# EAGLE design Precision Rectifier (EAGLE 5.11)
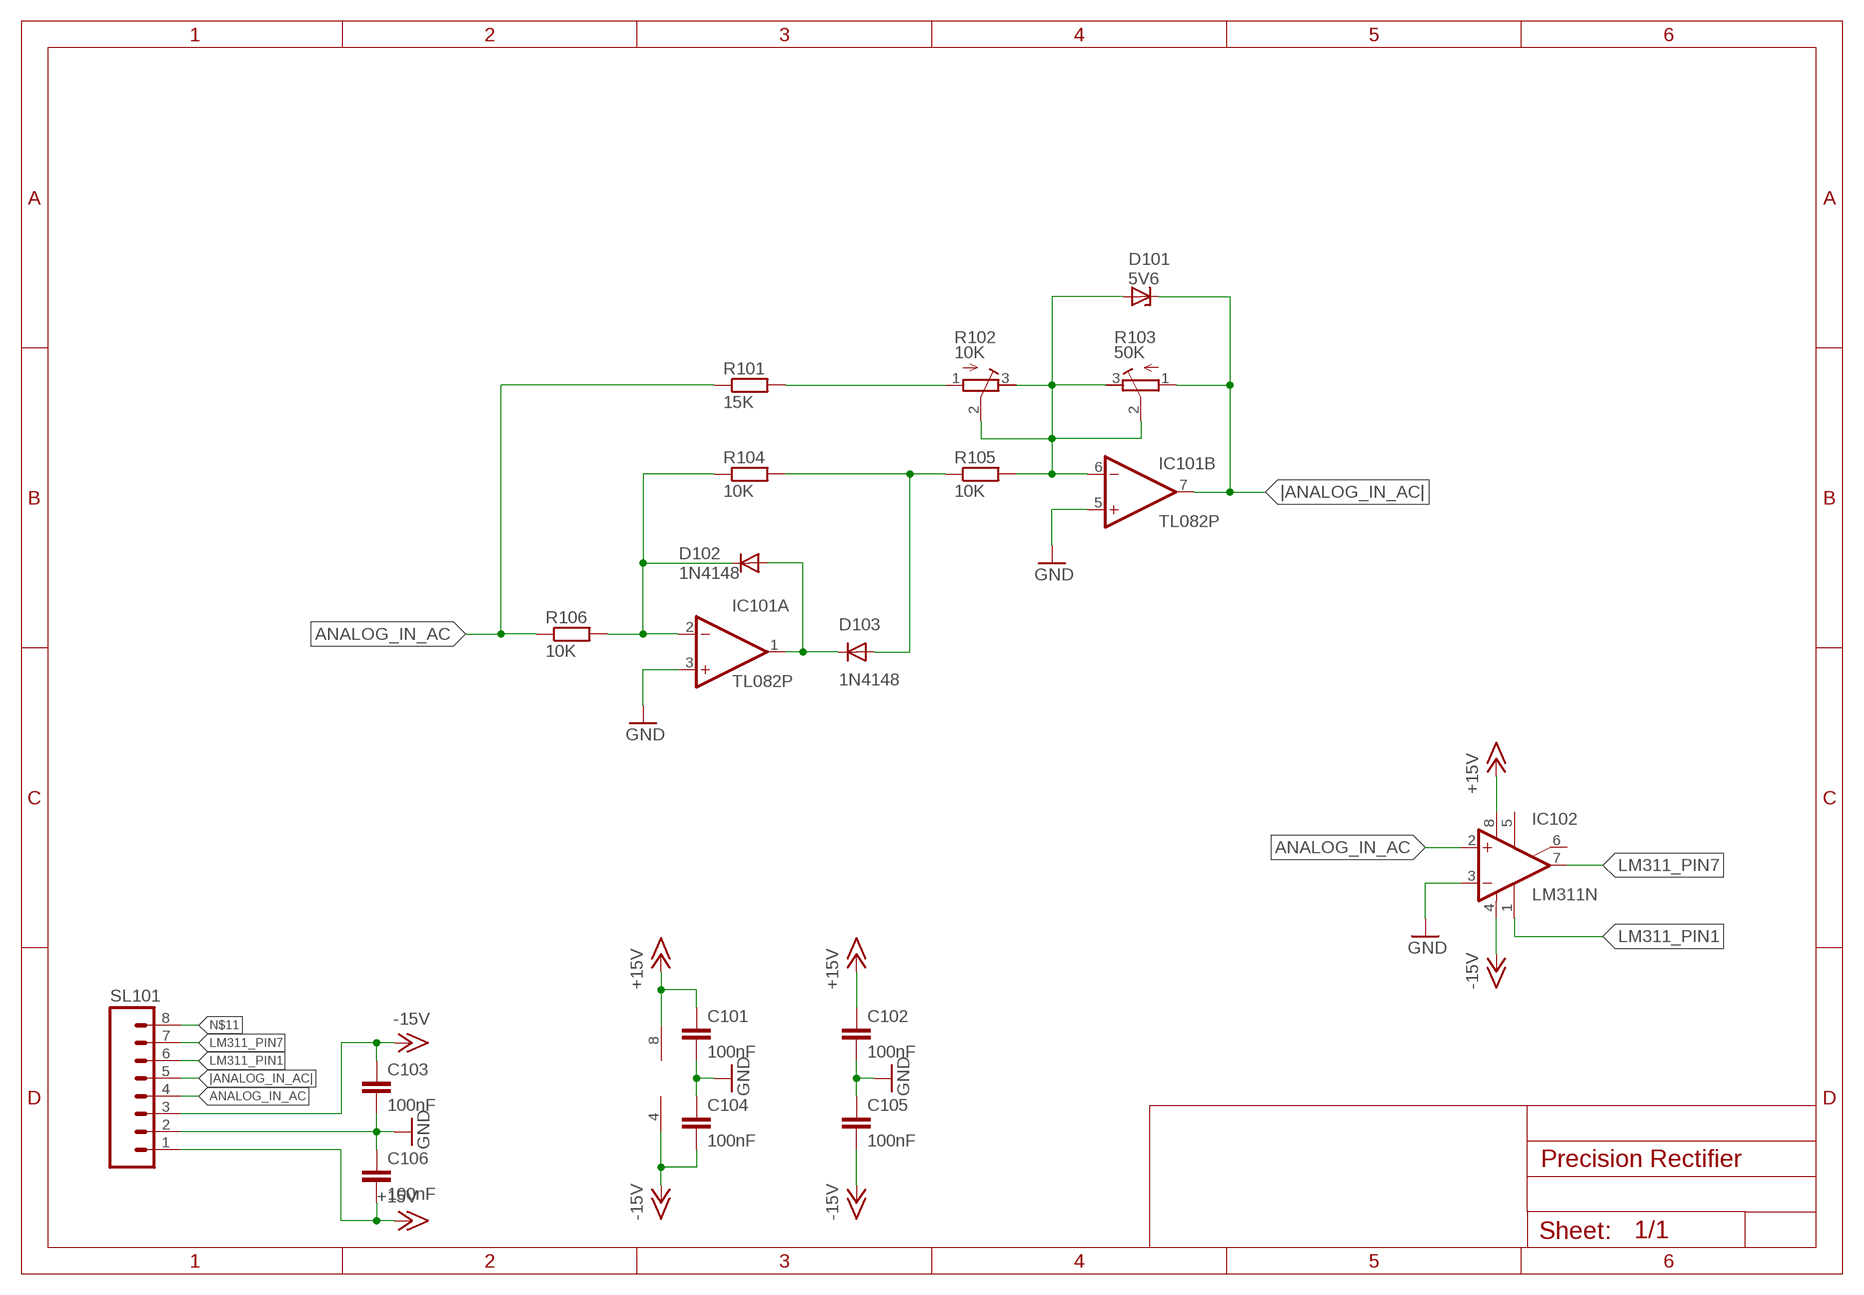
[diagram p0: schematic, sheet 1]

## Parts
C101  100nF  C-EUC1206  [C1206]
C102  100nF  C-EU050-024X044  [C050-024X044]
C103  100nF  C-EU050-024X044  [C050-024X044]
C104  100nF  C-EUC1206  [C1206]
C105  100nF  C-EU050-024X044  [C050-024X044]
C106  100nF  C-EU050-024X044  [C050-024X044]
D101  5V6  ZENER-DIODEZD-5  [ZDIO-5]
D102  1N4148  1N4148DO35-7  [DO35-7]
D103  1N4148  1N4148DO35-7  [DO35-7]
IC101  TL082P  [DIL08]
IC102  LM311N  [DIL08]
R101  15K  R-EU_0207/7  [0207/7]
R102  10K  R-TRIMM3296X  [RTRIM3296X]
R103  50K  R-TRIMM3296X  [RTRIM3296X]
R104  10K  R-EU_0207/7  [0207/7]
R105  10K  R-EU_0207/7  [0207/7]
R106  10K  R-EU_0207/7  [0207/7]
SL101  M08  [08P]

## Nets
+15V: C101.1 C102.1 C106.2 IC101.8(P:V+) IC102.8(V+) SL101.1
-15V: C103.1 C104.2 C105.2 IC101.4(P:V-) IC102.4(V-) SL101.3
ANALOG_IN_AC: IC102.2(+IN) R101.1 R106.1 SL101.4
GND: C101.2 C102.2 C103.2 C104.1 C105.1 C106.1 IC101.3(A:+IN) IC101.5(B:+IN) IC102.3(-IN) SL101.2
LM311_PIN1: IC102.1(GND) SL101.6
LM311_PIN7: IC102.7(OUT) SL101.7
N$1: D102.A D103.C IC101.1(A:OUT)
N$2: D102.C IC101.2(A:-IN) R104.1 R106.2
N$3: D103.A R104.2 R105.1
N$5: D101.A IC101.6(B:-IN) R102.2(S) R102.3(A) R103.2(S) R103.3(A) R105.2
N$6: R101.2 R102.1(E)
N$11: SL101.8
|ANALOG_IN_AC|: D101.C IC101.7(B:OUT) R103.1(E) SL101.5
Unconnected: IC102.5(ON) IC102.6(ON/STR)

## Library data of the parts
C101-C106 = rcl:C-EU: CAPACITOR, European symbol
D101 = diode:ZENER-DIODE: Z-Diode
D102 D103 = diode:1N4148: DIODE high speed (Philips)
IC101 = linear:TL082: OP AMP
IC102 = linear:LM311: COMPARATOR
R101 R104-R106 = rcl:R-EU_: RESISTOR, European symbol
R102 R103 = rcl:R-TRIMM: Trimm resistor
SL101 = con-amp-quick:M08: AMP QUICK CONNECTOR; OC_FARNELL: unknown; OC_NEWARK: unknown

## Board
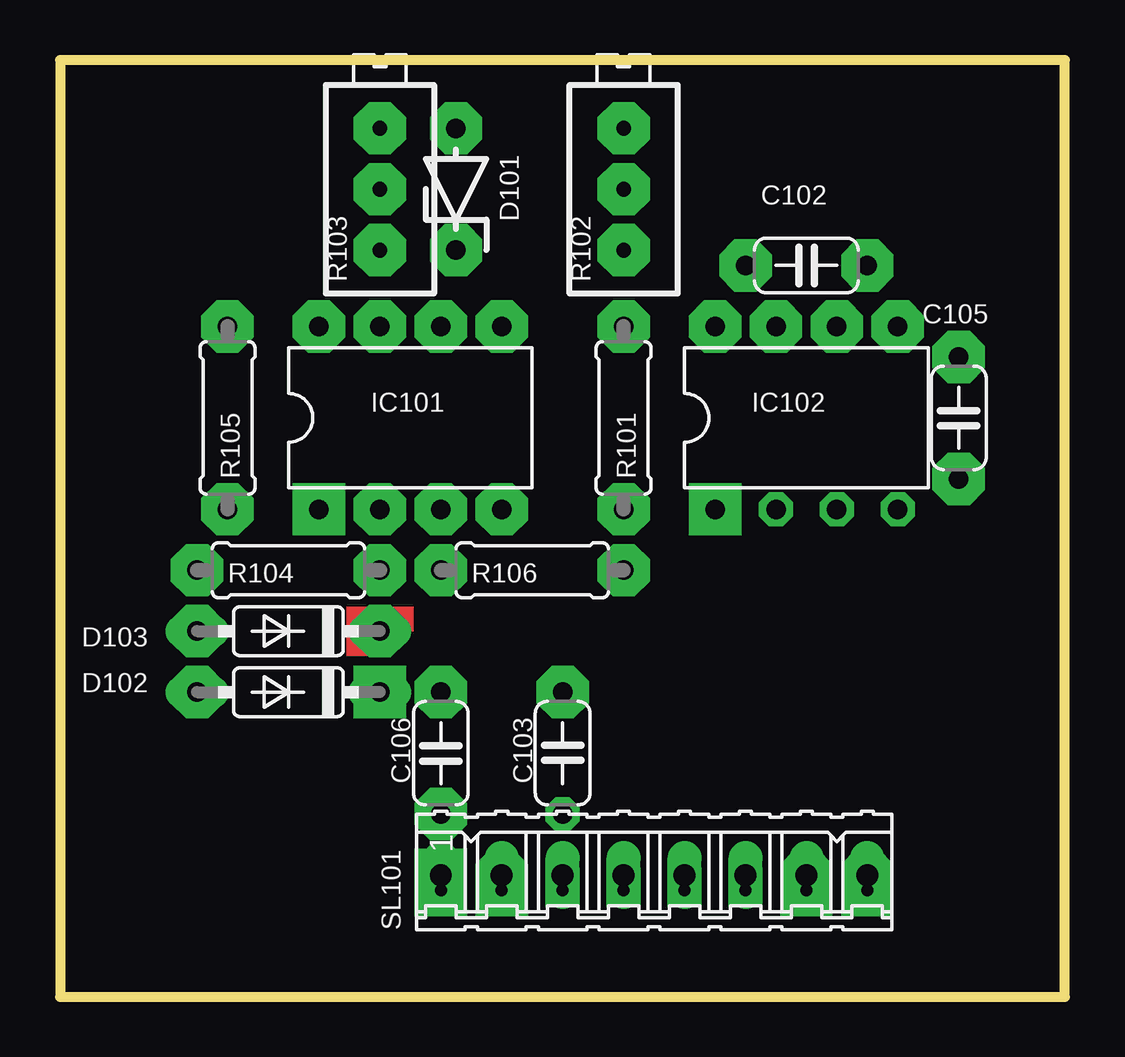
[diagram p1: board, top side]
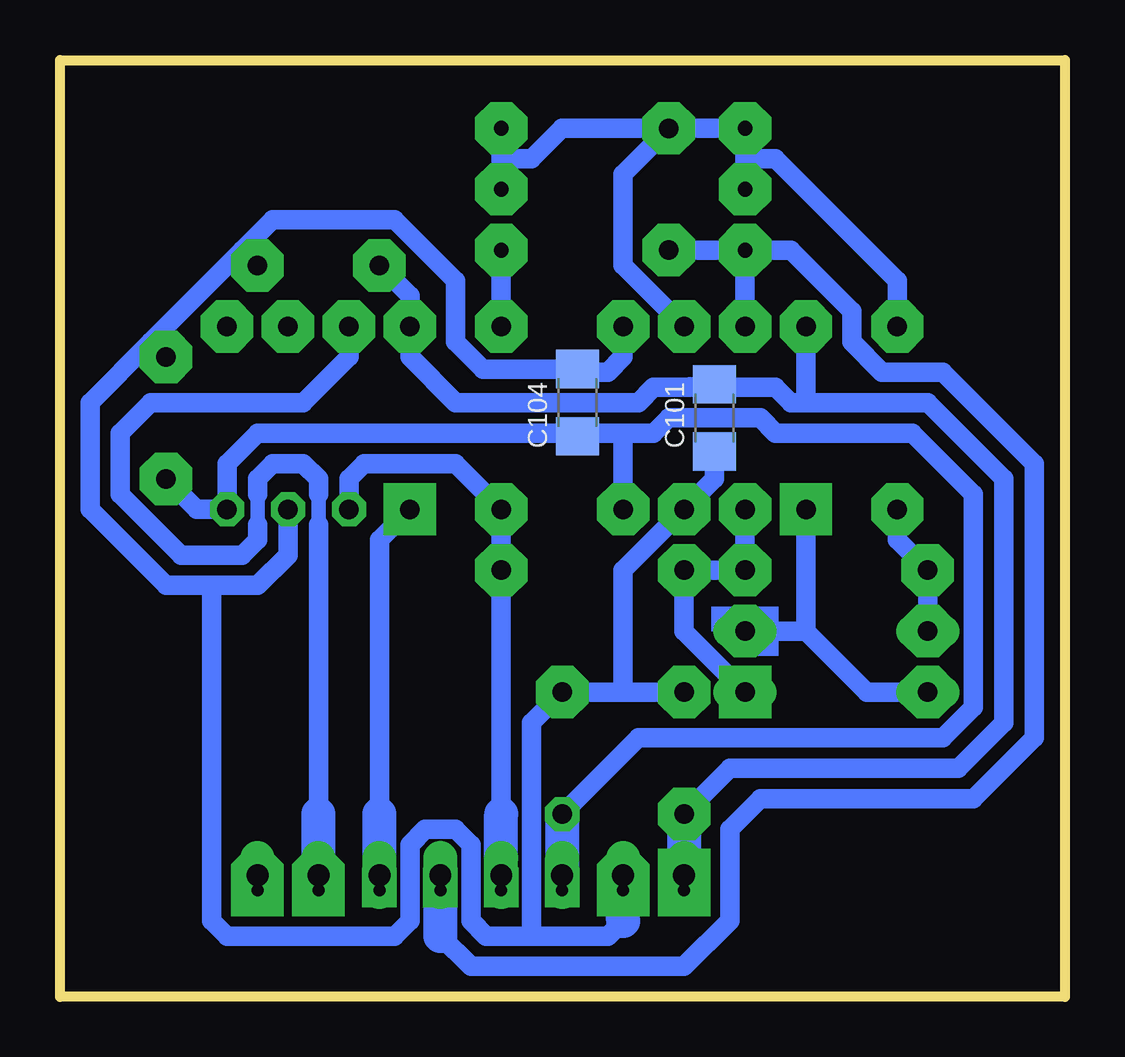
[diagram p2: board, bottom side, seen from below]

Size 41.89 x 39.04 mm. Coordinates in mm from the lower left corner, seen from the top.
Outline: 0,0 41.89,0 41.89,39.04 0,39.04 0,0
Copper layers (1*16): Top 0.035mm / dielectric 1.5mm / Bottom 0.035mm
Design rules "default": minimum track width 10mil, minimum drill 24mil, track to track 8mil, track to pad 8mil, pad to pad 8mil, via to via 8mil, smd to smd 8mil, copper to edge 40mil, drill to drill 8mil, minimum pad ring 10mil, minimum via ring 8mil, stop-mask expansion 4mil, vias tented up to drill 0mil, thermal gap 10mil

### Footprints (pad centres in the part's own frame; a part is rotated, then mirrored left to right if it is on the bottom)
C1206 = smd 1.6 x 1.8: 1 -1.4,0; 2 1.4,0
C050-024X044 = drill 0.813 octagon: 1 -2.54,0; 2 2.54,0
ZDIO-5 = drill 0.813 octagon: A 2.54,0; C -2.54,0
DO35-7 = drill 0.813 long: A 3.81,0; C -3.81,0
DIL08 = drill 0.813 pad 1.27 round: 1 -3.81,-3.81; 2 -1.27,-3.81; 3 1.27,-3.81; 4 3.81,-3.81; 5 3.81,3.81; 6 1.27,3.81; 7 -1.27,3.81; 8 -3.81,3.81
0207/7 = drill 0.813 octagon: 1 -3.81,0; 2 3.81,0
RTRIM3296X = drill 0.61 round: 1 0,-2.54; 2 0,0; 3 0,2.54
08P = drill 0.914 long: 1 -8.89,0; 2 -6.35,0; 3 -3.81,0; 4 -1.27,0; 5 1.27,0; 6 3.81,0; 7 6.35,0; 8 8.89,0

### Placement (x,y rotation side)
C101  14.61,24.13 270 bottom
C102  31.11,30.48 0 top
C103  20.95,10.16 90 top
C104  20.32,24.77 270 bottom
C105  37.47,24.13 270 top
C106  15.88,10.16 270 top
D101  16.51,33.66 90 top
D102  9.53,12.7 180 top
D103  9.53,15.24 180 top
IC101  14.61,24.13 0 top
IC102  31.11,24.13 0 top
R101  23.5,24.13 90 top
R102  23.5,33.66 0 top
R103  13.34,33.66 0 top
R104  9.53,17.78 180 top
R105  6.99,24.13 90 top
R106  19.68,17.78 180 top
SL101  24.77,5.08 0 top

### Tracks (layer width: path | path; a pad name or v marks a point on that pad's centre or on a via)
+15V  (via drill 0.5 pad 2.18)
  Bottom 0.813: 10.79,24.77 5.71,24.77 2.54,21.59 2.54,11.43 4.45,9.53 13.97,9.53 C106.2 | 10.79,24.77 11.43,24.77 12.06,25.4 15.88,25.4 | 15.88,25.4 17.14,25.4 17.78,24.77 25.4,24.77 27.3,26.67 IC102.8 27.3,29.21 C102.1 | 10.79,24.77 IC101.8 | 15.88,25.4 C101.1
  Bottom 1.422: C106.2 SL101.1
  other vias: 10.79,27.94 28.57,30.48 27.3,27.94 15.88,7.62 15.88,5.08
-15V  (via drill 0.5 pad 1.42, 0.5 pad 2.18)
  Bottom 0.813: 18.41,23.5 IC101.4 | 20.32,23.5 20.95,23.5 | 20.95,23.5 C104.2 20.32,23.5 | 18.41,23.5 17.14,23.5 16.51,24.13 12.7,24.13 12.06,23.5 6.35,23.5 3.81,20.95 3.81,12.06 5.08,10.79 17.78,10.79 C103.1 | 18.41,23.5 20.32,23.5 | 20.95,23.5 33.66,23.5 34.92,22.23 IC102.4 36.2,20.32 C105.2
  Bottom 1.422: C103.1 v20.95,5.08
  other vias: 18.41,20.32 34.92,20.32 37.47,21.59 20.95,7.62
ANALOG_IN_AC  (via drill 0.5 pad 1.42, 0.5 pad 2.18)
  Bottom 0.813: IC102.2 29.84,21.59 29.21,22.23 25.4,22.23 R101.1 v23.5,17.78 23.5,7.62
  Bottom 1.422: SL101.4 23.5,7.62
  other vias: 29.84,20.32 23.5,5.08 23.5,20.32
GND  (via drill 0.5 pad 1.42, 0.5 pad 2.18)
  Bottom 0.406: 34.29,31.11 C102.2
  Bottom 0.813: IC101.5 18.41,26.67 19.05,26.04 20.19,26.04 C104.1 24.26,26.16 25.4,27.3 25.4,29.84 27.94,32.38 33.02,32.38 34.29,31.11 38.1,27.3 | 18.41,12.7 18.41,17.78 IC101.3 14.61,21.59 C101.2 | 18.41,3.17 19.05,2.54 22.23,2.54 | 22.23,2.54 22.23,11.43 C103.2 18.41,12.7 | 35.56,17.14 35.56,3.17 34.92,2.54 27.94,2.54 27.3,3.17 27.3,6.35 26.67,6.99 25.4,6.99 24.77,6.35 24.77,3.17 24.13,2.54 22.23,2.54 | 35.56,17.14 37.47,17.14 40.64,20.32 40.64,24.77 38.1,27.3 | IC102.3 32.38,18.41 33.66,17.14 35.56,17.14 | 18.41,12.7 C106.1 | 38.1,27.3 C105.1
  Bottom 1.422: 18.41,3.17 v18.41,4.45 SL101.2
  other vias: 15.88,20.32 33.66,30.48 32.38,20.32 37.47,26.67 20.95,12.7 15.88,12.7 18.41,27.94 18.41,5.08
LM311_PIN1  (via drill 0.5 pad 1.42, 0.5 pad 2.18)
  Bottom 0.813: 28.57,7.62 28.57,19.05 IC102.1
  Bottom 1.422: SL101.6 28.57,7.62
  other vias: 27.3,20.32 28.57,5.08
LM311_PIN7  (via drill 0.5 pad 2.18)
  Bottom 0.61: 33.66,20.95 33.66,19.68 | 31.11,19.68 31.11,20.95
  Bottom 0.813: IC102.7 29.84,26.67 31.75,24.77 38.1,24.77 39.37,23.5 39.37,20.95 36.83,18.41 34.29,18.41 33.66,19.05 33.66,19.68 | 33.66,20.95 33.66,21.59 33.02,22.23 31.75,22.23 31.11,21.59 31.11,20.95 | 31.11,7.62 31.11,19.68
  Bottom 1.422: v31.11,5.08 31.11,7.62
  other vias: 29.84,27.94
N$1  (via drill 0.5 pad 2.18)
  Bottom 0.813: 10.79,15.24 IC101.1 | 10.79,15.24 8.26,12.7 D102.A | 10.79,15.24 D103.C
  other vias: 10.79,20.32 13.34,15.24 5.71,12.7
N$2  (via drill 0.5 pad 2.18)
  Bottom 0.813: IC101.2 R104.1 v15.88,17.78 15.88,15.24 D102.C
  other vias: 13.34,20.32 13.34,12.7 13.34,17.78
N$3  (via drill 0.5 pad 2.18)
  Bottom 0.813: R105.1 6.99,19.05 R104.2 D103.A
  other vias: 5.71,15.24 5.71,17.78 6.99,20.32
N$4  (via drill 0.5 pad 2.18)
  other vias: 33.66,5.08
N$5  (via drill 0.5 pad 2.18)
  Bottom 0.813: R103.3 R103.2 | R105.2 6.99,29.84 12.06,34.92 13.34,34.92 R103.3 | R103.3 D101.A | IC101.6 18.41,30.48 18.41,34.29 D101.A | D101.A 20.95,36.2 22.23,34.92 23.5,34.92 R102.3 R102.2
  other vias: 13.34,33.66 13.34,36.2 16.51,36.2 15.88,27.94 6.99,27.94 23.5,33.66 23.5,36.2
N$6  (via drill 0.5 pad 2.18)
  Bottom 0.813: R101.2 v23.5,31.11
  other vias: 23.5,27.94
N$7  (via drill 0.5 pad 2.18)
  other vias: 32.38,27.94
N$8  (via drill 0.5 pad 2.18)
  other vias: 34.92,27.94
N$9  (via drill 0.5 pad 2.18)
  other vias: 15.88,4.45
N$10  (via drill 0.5 pad 2.18)
  other vias: 31.11,4.45
N$12  (via drill 0.5 pad 2.18)
  other vias: 33.66,4.45
N$13  (via drill 0.5 pad 1.42)
  other vias: 20.95,4.45
N$14  (via drill 0.5 pad 1.42)
  other vias: 23.5,4.45
N$15  (via drill 0.5 pad 1.42)
  other vias: 28.57,4.45
|ANALOG_IN_AC|  (via drill 0.5 pad 1.42, 0.5 pad 2.18)
  Bottom 0.813: v13.34,31.11 IC101.7 | v13.34,31.11 v16.51,31.11 | 26.04,2.54 24.77,1.27 15.88,1.27 13.97,3.17 13.97,6.99 12.7,8.26 3.81,8.26 1.27,10.79 1.27,22.23 5.08,26.04 7.62,26.04 8.89,27.3 8.89,28.57 11.43,31.11 v13.34,31.11
  Bottom 1.422: 26.04,2.54 v26.04,4.45 SL101.5
  other vias: 13.34,27.94 26.04,5.08
(copper drawn outside any net)
  shapes: Bottom area x2, Top area x2